# Altium project RHD2132_64CH.PrjPcb
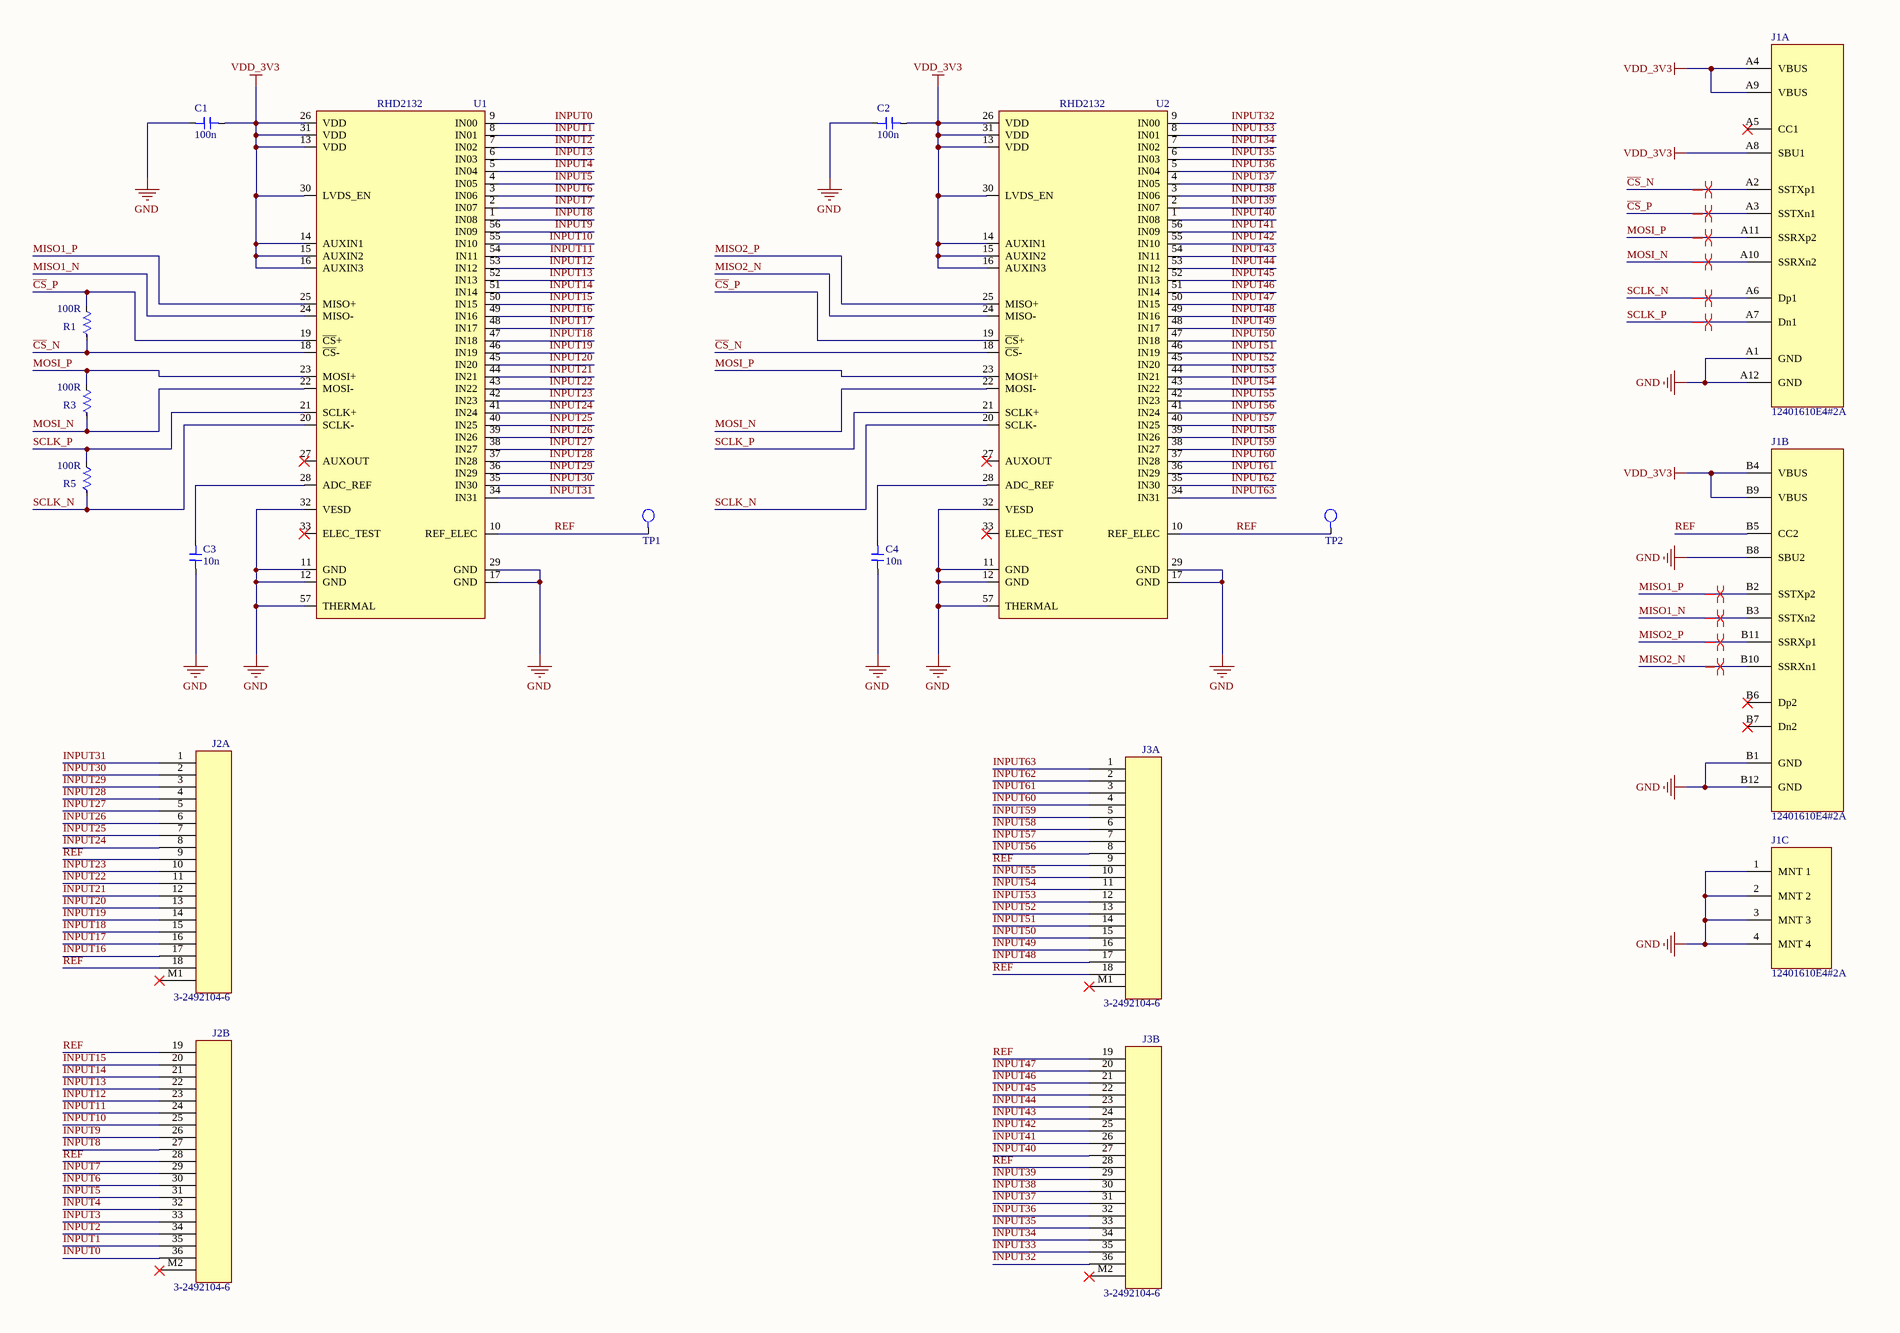
[diagram p0: RHD2132_64CH.SchDoc, left]
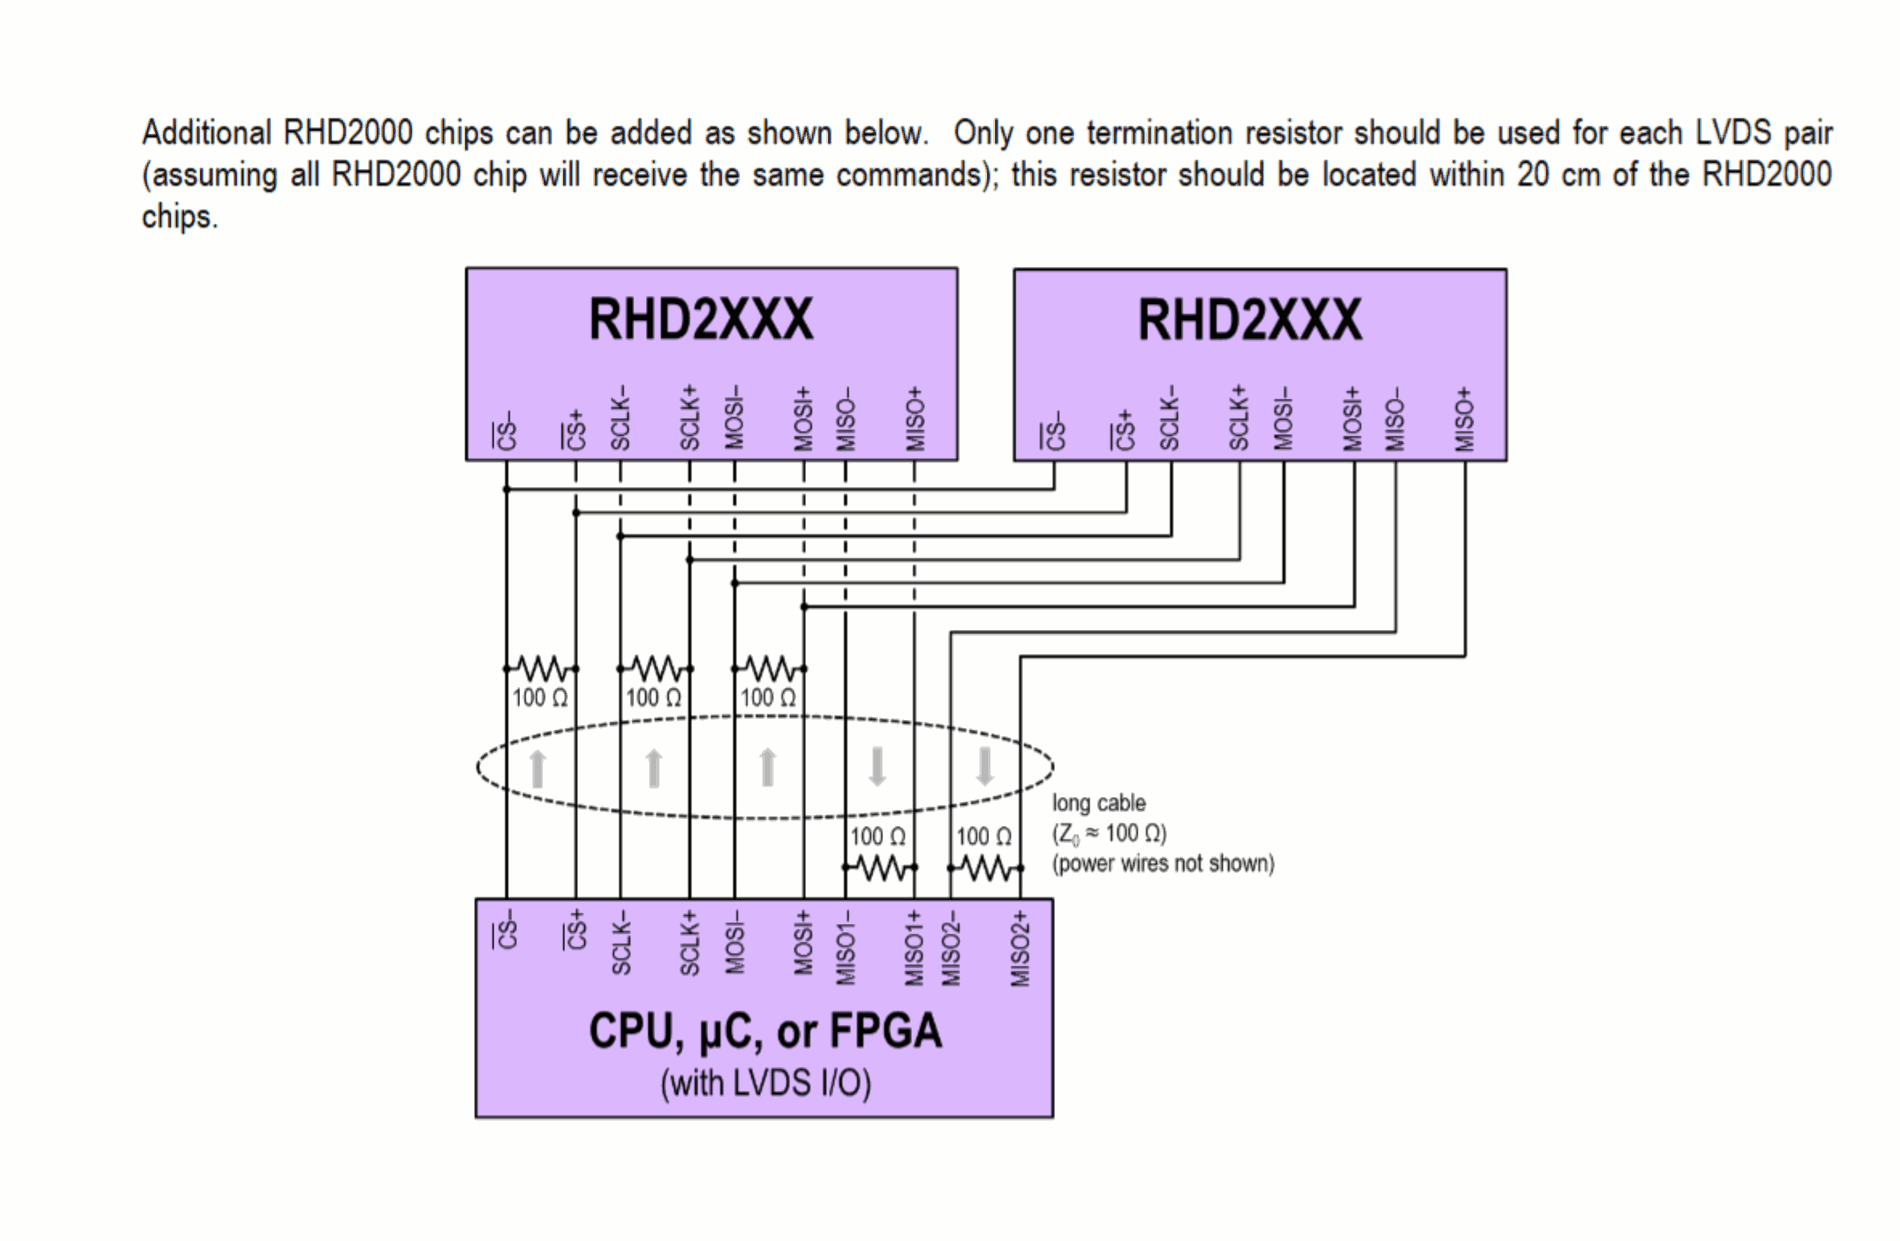
[diagram p1: RHD2132_64CH.SchDoc, right]
Project_Date: 2026-09-01; Project_DateCode: DC260901; Project_Designer1: Olivier Bergeron; Project_Designer2: Quentin Mascret; Project_Designer3: Benoit Gosselin; Project_Global: UHDEMG; Project_Group: SBioML; Project_Name: RHD2132_64CH; Project_Revision: 2.000; Project_Stencil_Bot_Thickness: 0.1 MM; Project_Stencil_Top_Thickness: 0.1 MM
1 sheet, 14 parts. Net scope: flat (ports and power ports of the same name join across sheets).
Board file: RHD2132_64CH.PcbDoc

## Sheet RHD2132_64CH.SchDoc
size Tabloid; SheetNumber: 1; SheetTotal: 1; Sheet_Name: RHD2132 64CH; Size: 11x17

### Parts
C1  100n  [0402_CAPACITOR]
C2  100n  [0402_CAPACITOR]
C3  10n  [0402_CAPACITOR]
C4  10n  [0402_CAPACITOR]
J1  12401610E4#2A  [CON_USB_C_SMD]  (parts A,B,C of 3)
J2  3-2492104-6  [CON_ZIF_RA_36POS]  (parts A,B of 2)
J3  3-2492104-6  [CON_ZIF_RA_36POS]  (parts A,B of 2)
R1  100R  [0402_Resistor]
R3  100R  [0402_Resistor]
R5  100R  [0402_Resistor]
TP1  TP_Small  [TP_Small_M2]  (value not drawn)
TP2  TP_Small  [TP_Small_M2]  (value not drawn)
U1  RHD2132  [QFN-56]
U2  RHD2132  [QFN-56]

### Nets
GND: C1.1 C2.1 C3.1 C4.1 J1.1(MNT_1) J1.2(MNT_2) J1.3(MNT_3) J1.4(MNT_4) J1.A1(GND) J1.A12(GND) J1.B1(GND) J1.B8(SBU2) J1.B12(GND) U1.11(GND) U1.12(GND) U1.17(GND) U1.29(GND) U1.32(VESD) U1.57(THERMAL) U2.11(GND) U2.12(GND) U2.17(GND) U2.29(GND) U2.32(VESD) U2.57(THERMAL)
VDD_3V3: C1.2 C2.2 J1.A4(VBUS) J1.A8(SBU1) J1.A9(VBUS) J1.B4(VBUS) J1.B9(VBUS) U1.13(VDD) U1.14(AUXIN1) U1.15(AUXIN2) U1.16(AUXIN3) U1.26(VDD) U1.30(LVDS_EN) U1.31(VDD) U2.13(VDD) U2.14(AUXIN1) U2.15(AUXIN2) U2.16(AUXIN3) U2.26(VDD) U2.30(LVDS_EN) U2.31(VDD)
~{CS}_N: J1.A2(SSTXp1) R1.1 U1.18(~{CS}-) U2.18(~{CS}-)
~{CS}_P: J1.A3(SSTXn1) R1.2 U1.19(~{CS}+) U2.19(~{CS}+)
INPUT0: J2.36 U1.9(IN00)
INPUT1: J2.35 U1.8(IN01)
INPUT2: J2.34 U1.7(IN02)
INPUT3: J2.33 U1.6(IN03)
INPUT4: J2.32 U1.5(IN04)
INPUT5: J2.31 U1.4(IN05)
INPUT6: J2.30 U1.3(IN06)
INPUT7: J2.29 U1.2(IN07)
INPUT8: J2.27 U1.1(IN08)
INPUT9: J2.26 U1.56(IN09)
INPUT10: J2.25 U1.55(IN10)
INPUT11: J2.24 U1.54(IN11)
INPUT12: J2.23 U1.53(IN12)
INPUT13: J2.22 U1.52(IN13)
INPUT14: J2.21 U1.51(IN14)
INPUT15: J2.20 U1.50(IN15)
INPUT16: J2.17 U1.49(IN16)
INPUT17: J2.16 U1.48(IN17)
INPUT18: J2.15 U1.47(IN18)
INPUT19: J2.14 U1.46(IN19)
INPUT20: J2.13 U1.45(IN20)
INPUT21: J2.12 U1.44(IN21)
INPUT22: J2.11 U1.43(IN22)
INPUT23: J2.10 U1.42(IN23)
INPUT24: J2.8 U1.41(IN24)
INPUT25: J2.7 U1.40(IN25)
INPUT26: J2.6 U1.39(IN26)
INPUT27: J2.5 U1.38(IN27)
INPUT28: J2.4 U1.37(IN28)
INPUT29: J2.3 U1.36(IN29)
INPUT30: J2.2 U1.35(IN30)
INPUT31: J2.1 U1.34(IN31)
INPUT32: J3.36 U2.9(IN00)
INPUT33: J3.35 U2.8(IN01)
INPUT34: J3.34 U2.7(IN02)
INPUT35: J3.33 U2.6(IN03)
INPUT36: J3.32 U2.5(IN04)
INPUT37: J3.31 U2.4(IN05)
INPUT38: J3.30 U2.3(IN06)
INPUT39: J3.29 U2.2(IN07)
INPUT40: J3.27 U2.1(IN08)
INPUT41: J3.26 U2.56(IN09)
INPUT42: J3.25 U2.55(IN10)
INPUT43: J3.24 U2.54(IN11)
INPUT44: J3.23 U2.53(IN12)
INPUT45: J3.22 U2.52(IN13)
INPUT46: J3.21 U2.51(IN14)
INPUT47: J3.20 U2.50(IN15)
INPUT48: J3.17 U2.49(IN16)
INPUT49: J3.16 U2.48(IN17)
INPUT50: J3.15 U2.47(IN18)
INPUT51: J3.14 U2.46(IN19)
INPUT52: J3.13 U2.45(IN20)
INPUT53: J3.12 U2.44(IN21)
INPUT54: J3.11 U2.43(IN22)
INPUT55: J3.10 U2.42(IN23)
INPUT56: J3.8 U2.41(IN24)
INPUT57: J3.7 U2.40(IN25)
INPUT58: J3.6 U2.39(IN26)
INPUT59: J3.5 U2.38(IN27)
INPUT60: J3.4 U2.37(IN28)
INPUT61: J3.3 U2.36(IN29)
INPUT62: J3.2 U2.35(IN30)
INPUT63: J3.1 U2.34(IN31)
MISO1_N: J1.B3(SSTXn2) U1.24(MISO-)
MISO1_P: J1.B2(SSTXp2) U1.25(MISO+)
MISO2_N: J1.B10(SSRXn1) U2.24(MISO-)
MISO2_P: J1.B11(SSRXp1) U2.25(MISO+)
MOSI_N: J1.A10(SSRXn2) R3.1 U1.22(MOSI-) U2.22(MOSI-)
MOSI_P: J1.A11(SSRXp2) R3.2 U1.23(MOSI+) U2.23(MOSI+)
REF: J1.B5(CC2) J2.9 J2.18 J2.19 J2.28 J3.9 J3.18 J3.19 J3.28 TP1.1 TP2.1 U1.10(REF_ELEC) U2.10(REF_ELEC)
SCLK_N: J1.A6(Dp1) R5.1 U1.20(SCLK-) U2.20(SCLK-)
SCLK_P: J1.A7(Dn1) R5.2 U1.21(SCLK+) U2.21(SCLK+)
NetC3_2: C3.2 U1.28(ADC_REF)
NetC4_2: C4.2 U2.28(ADC_REF)

Not connected (* = marked no-connect by the designer): J1 A5(CC1)* B6(Dp2)* B7(Dn2)*; J2 M1* M2*; J3 M1* M2*; U1 27(AUXOUT)* 33(ELEC_TEST)*; U2 27(AUXOUT)* 33(ELEC_TEST)*

### Layout directives
differential pair: MISO1_N, MISO1_P, MISO2_N, MISO2_P, MOSI_N, MOSI_P, SCLK_N, SCLK_P, ~{CS}_N, ~{CS}_P

### Notes on the sheet
- Sheet Name
- Project Title
- Global Project
- Size
- Group
- Revision
- Date
- Sheet
- of
- Filename
- Designers

### Library data of the parts
C1-C4 = Capacitor
J1 = CON_USBC_TH_SMT: USB-C (USB TYPE-C) USB 3.2 Gen 1 (USB 3.1 Gen 1, Superspeed (USB 3.0)) Receptacle Connector 24 Position Through Hole, Right Angle
J2 J3 = CON_ZIF_RA_36POS: 36 Position FPC Connector Contacts, Bottom 0.020" (0.50mm) Surface Mount, Right Angle; GRAMS Lib Spec: 2.7
R1 R3 R5 = Resistor: GRAMS Lib Spec: 2.7
TP1 TP2 = TP_Small: Through Hole Test Point - M2
U1 U2 = IC_RHD2132: INTAN RHD2132 - 56-QFN; GRAMS Lib Spec: 2.7